# Altium project Ejemplo5.PrjPcb
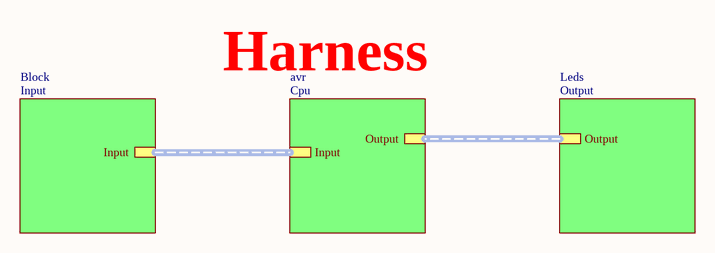
[diagram p0: main.SchDoc]
4 sheets, 19 parts. Net scope: hierarchical (ports join the sheet entries above them; power ports are global).
Board file: PCB4.PcbDoc
Sheets:
  main.SchDoc
    Block = Input.SchDoc
    Leds = Output.SchDoc
    avr = Cpu.SchDoc

## Sheet main.SchDoc
size A4; SheetNumber: 1; SheetTotal: 4

### Sub-sheets
avr = Cpu: Input, Output
Block = Input: Input
Leds = Output: Output

### Buses and harness runs
harness sheet avr/Input = sheet Block/Input
harness sheet avr/Output = sheet Leds/Output

### Notes on the sheet
- Harness

## Sheet Input.SchDoc
size A4; SheetNumber: 2; SheetTotal: 4
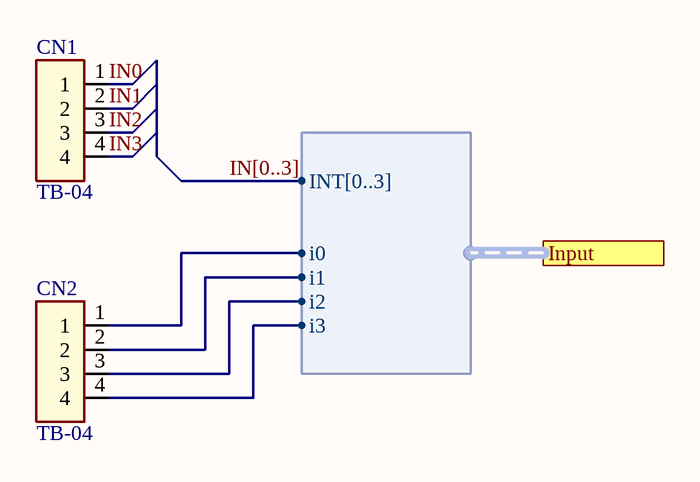
[diagram p1: Input.SchDoc]

### Parts
CN1  TB-04  [TB508-04]
CN2  TB-04  [TB508-04]

### Ports
Input (harness Input)

### Harnesses
Input: INT[0..3], i0, i1, i2, i3

### Nets
IN0: CN1.1
IN1: CN1.2
IN2: CN1.3
IN3: CN1.4
In5: CN2.2 ; port Input.i1
In6: CN2.3 ; port Input.i2
In7: CN2.4 ; port Input.i3
NetCN2_1: CN2.1 ; port Input.i0

### Buses and harness runs
bus IN[0..3]

### Library data of the parts
CN1 CN2 = TB-04: Terminal Block; Manufacturer: *; Part number: *; Unit price: *; Value: TB-04

## Sheet Output.SchDoc
size A4; SheetNumber: 4; SheetTotal: 4
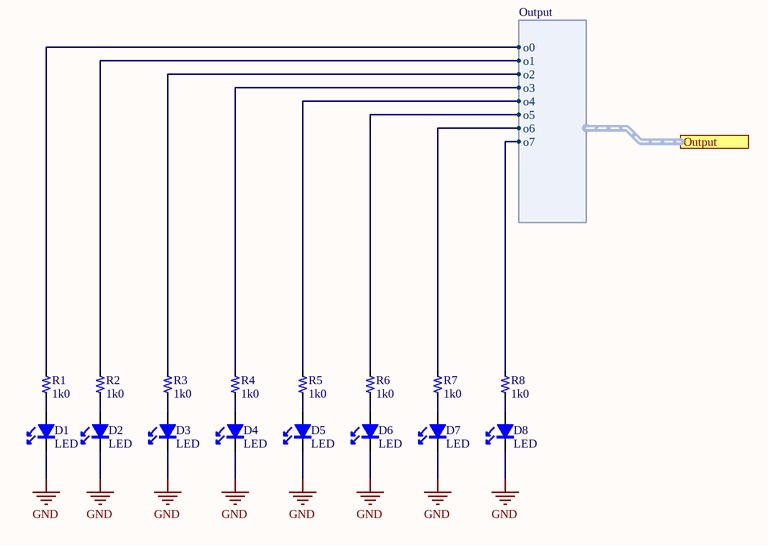
[diagram p2: Output.SchDoc]

### Parts
D1  LED  [LED-0805]
D2  LED  [LED-0805]
D3  LED  [LED-0805]
D4  LED  [LED-0805]
D5  LED  [LED-0805]
D6  LED  [LED-0805]
D7  LED  [LED-0805]
D8  LED  [LED-0805]
R1  1k0  [R0805]
R2  1k0  [R0805]
R3  1k0  [R0805]
R4  1k0  [R0805]
R5  1k0  [R0805]
R6  1k0  [R0805]
R7  1k0  [R0805]
R8  1k0  [R0805]

### Ports
Output (harness Output)

### Harnesses
Output: o0, o1, o2, o3, o4, o5, o6, o7

### Nets
GND: D1.1 D2.1 D3.1 D4.1 D5.1 D6.1 D7.1 D8.1
Out0: R1.2 ; port Output.o0
Out1: R2.2 ; port Output.o1
Out2: R3.2 ; port Output.o2
Out3: R4.2 ; port Output.o3
Out4: R5.2 ; port Output.o4
Out5: R6.2 ; port Output.o5
Out6: R7.2 ; port Output.o6
Out7: R8.2 ; port Output.o7
NetD1_2: D1.2 R1.1
NetD2_2: D2.2 R2.1
NetD3_2: D3.2 R3.1
NetD4_2: D4.2 R4.1
NetD5_2: D5.2 R5.1
NetD6_2: D6.2 R6.1
NetD7_2: D7.2 R7.1
NetD8_2: D8.2 R8.1

### Library data of the parts
D1-D8 = LED: LED - Light-Emitting Diode; Manufacturer: *; Part number: *; Unit price: *; Value: LED
R1-R8 = Resistor: Single resistor; Power: 0.125W; Manufacturer: *; Part number: *; Value: 1k0; Unit price: 0.1

## Sheet Cpu.SchDoc
size A4; SheetNumber: 3; SheetTotal: 4
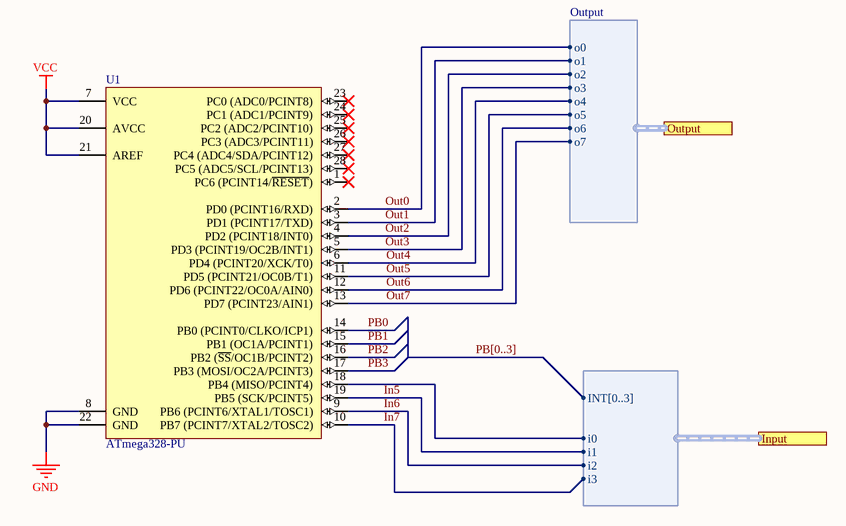
[diagram p3: Cpu.SchDoc]

### Parts
U1  ATmega328-PU  [28P3]

### Ports
Input (harness Input), Output (harness Output)

### Harnesses
Input: INT[0..3], i0, i1, i2, i3
Output: o0, o1, o2, o3, o4, o5, o6, o7

### Nets
GND: U1.8(GND) U1.22(GND)
VCC: U1.7(VCC) U1.20(AVCC) U1.21(AREF)
In5: U1.19(PB5_(SCK/PCINT5)) ; port Input.i1
In6: U1.9(PB6_(PCINT6/XTAL1/TOSC1)) ; port Input.i2
In7: U1.10(PB7_(PCINT7/XTAL2/TOSC2)) ; port Input.i3
Out0: U1.2(PD0_(PCINT16/RXD)) ; port Output.o0
Out1: U1.3(PD1_(PCINT17/TXD)) ; port Output.o1
Out2: U1.4(PD2_(PCINT18/INT0)) ; port Output.o2
Out3: U1.5(PD3_(PCINT19/OC2B/INT1)) ; port Output.o3
Out4: U1.6(PD4_(PCINT20/XCK/T0)) ; port Output.o4
Out5: U1.11(PD5_(PCINT21/OC0B/T1)) ; port Output.o5
Out6: U1.12(PD6_(PCINT22/OC0A/AIN0)) ; port Output.o6
Out7: U1.13(PD7_(PCINT23/AIN1)) ; port Output.o7
PB0: U1.14(PB0_(PCINT0/CLKO/ICP1))  [project net IN0]
PB1: U1.15(PB1_(OC1A/PCINT1))  [project net IN1]
PB2: U1.16(PB2_(~{SS}/OC1B/PCINT2))  [project net IN2]
PB3: U1.17(PB3_(MOSI/OC2A/PCINT3))  [project net IN3]
NetCN2_1: U1.18(PB4_(MISO/PCINT4)) ; port Input.i0

Not connected (* = marked no-connect by the designer): U1 1(PC6_(PCINT14/~{RESET}))* 23(PC0_(ADC0/PCINT8))* 24(PC1_(ADC1/PCINT9))* 25(PC2_(ADC2/PCINT10))* 26(PC3_(ADC3/PCINT11))* 27(PC4_(ADC4/SDA/PCINT12))* 28(PC5_(ADC5/SCL/PCINT13))*

### Buses and harness runs
bus PB[0..3]

### Library data of the parts
U1 = CMP-0095-00015-2: 8-bit AVR Microcontroller, 32KB Flash, 1KB EEPROM, 2KB SRAM, 28-pin PDIP, Industrial Grade (-40°C to 85°C); ComponentLink3Description: ATmega48A/48PA/88A/88PA/168A/168PA/328/328P Summary; RevisionNote: DatasheetVersion updated. URLs added.; DatasheetVersion: revD, May-2011; ComponentLink1URL: http://www.atmel.com/; PackageVersion: revB, Sep-2001; PackageDescription: 28-lead (0.300"/7.62mm Wide) Plastic Dual Inline Package (PDIP); PackageReference: 28P3; ComponentLink1Description: Manufacturer URL; ComponentLink2Description: ATmega48A/48PA/88A/88PA/168A/168PA/328/328P Datasheet; ComponentLink3URL: http://www.atmel.com/dyn/resources/prod_documents/8271S.pdf; ComponentLink2URL: http://www.atmel.com/dyn/resources/prod_documents/8271.pdf

## Nets that join several sheets
GND: Output (8 pins), Cpu (U1.8 U1.22)
IN0: Input (CN1.1), Cpu (U1.14)
IN1: Input (CN1.2), Cpu (U1.15)
IN2: Input (CN1.3), Cpu (U1.16)
IN3: Input (CN1.4), Cpu (U1.17)
In5: Input (CN2.2), Cpu (U1.19)
In6: Input (CN2.3), Cpu (U1.9)
In7: Input (CN2.4), Cpu (U1.10)
NetCN2_1: Input (CN2.1), Cpu (U1.18)
Out0: Output (R1.2), Cpu (U1.2)
Out1: Output (R2.2), Cpu (U1.3)
Out2: Output (R3.2), Cpu (U1.4)
Out3: Output (R4.2), Cpu (U1.5)
Out4: Output (R5.2), Cpu (U1.6)
Out5: Output (R6.2), Cpu (U1.11)
Out6: Output (R7.2), Cpu (U1.12)
Out7: Output (R8.2), Cpu (U1.13)